# EAGLE design memory (EAGLE 7.1.0)
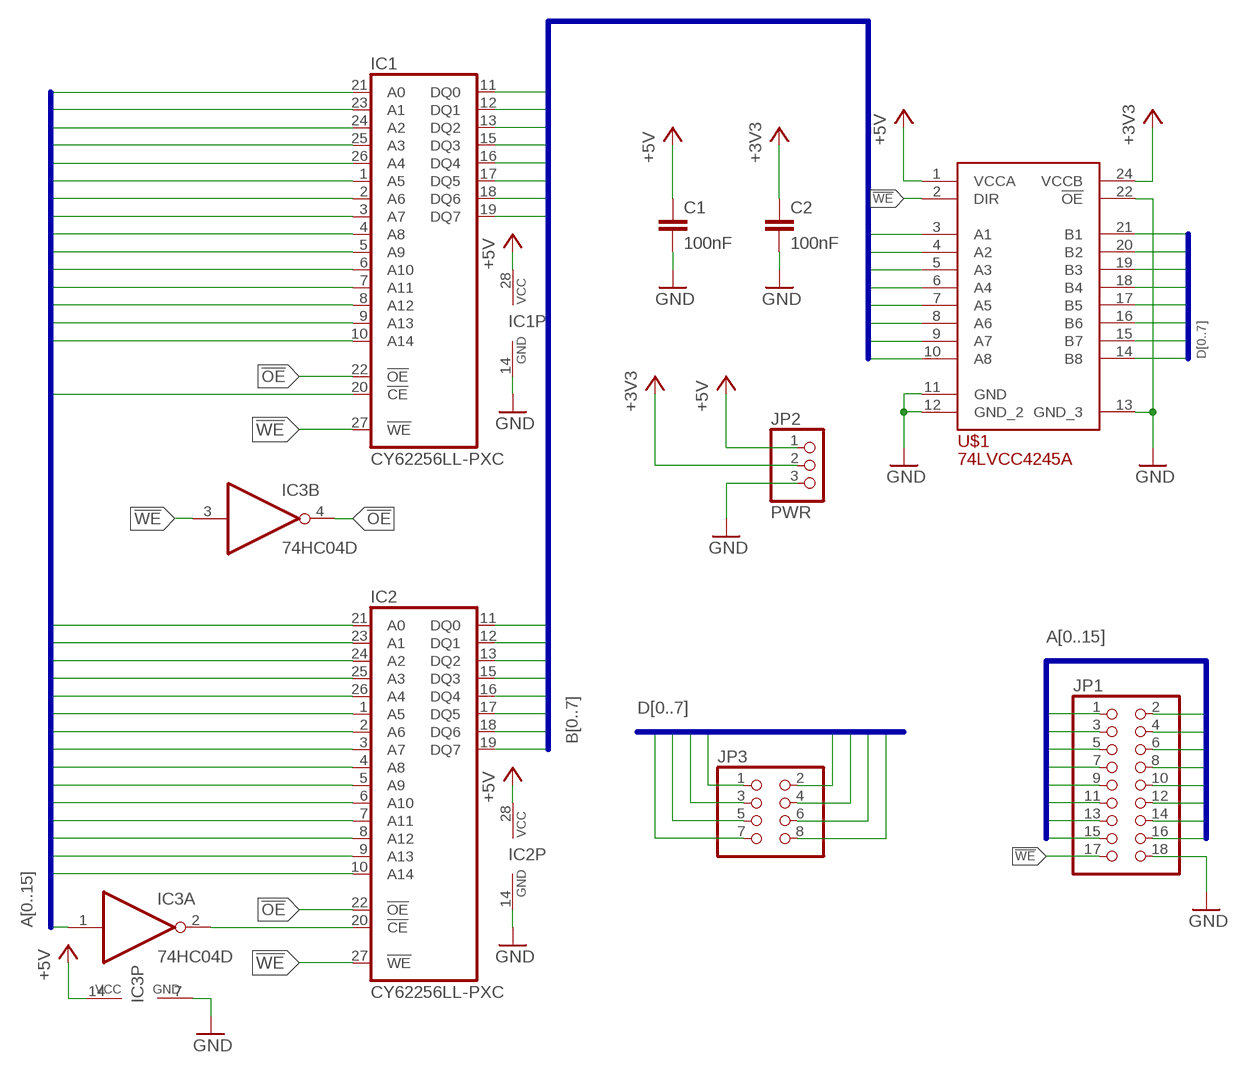
[diagram p0: schematic, sheet 1]

## Parts
C1  100nF  C-EUC0805  [C0805]
C2  100nF  C-EUC0805  [C0805]
IC1  CY62256LL-PXC  [DIL28-6]
IC2  CY62256LL-PXC  [DIL28-6]
IC3  74HC04D  [SO14]
JP1  PINHD-2X9  [2X09]
JP2  PWR  PINHD-1X3  [1X03]
JP3  PINHD-2X4  [2X04]
U$1  74LCC4245A  [SO24W]

## Nets
!OE!: IC1.22(!OE) IC2.22(!OE) IC3.4(B:O)
!WE!: IC1.27(!WE) IC2.27(!WE) IC3.3(B:I) JP1.17 U$1.2(DIR)
+3V3: C2.1 JP2.2 U$1.24(VCCB)
+5V: C1.1 IC1.28(VCC) IC2.28(VCC) IC3.14(P:VCC) JP2.1 U$1.1(VCCA)
A0: IC1.21(A0) IC2.21(A0) JP1.1
A1: IC1.23(A1) IC2.23(A1) JP1.2
A2: IC1.24(A2) IC2.24(A2) JP1.3
A3: IC1.25(A3) IC2.25(A3) JP1.4
A4: IC1.26(A4) IC2.26(A4) JP1.5
A5: IC1.1(A5) IC2.1(A5) JP1.6
A6: IC1.2(A6) IC2.2(A6) JP1.7
A7: IC1.3(A7) IC2.3(A7) JP1.8
A8: IC1.4(A8) IC2.4(A8) JP1.9
A9: IC1.5(A9) IC2.5(A9) JP1.10
A10: IC1.6(A10) IC2.6(A10) JP1.11
A11: IC1.7(A11) IC2.7(A11) JP1.12
A12: IC1.8(A12) IC2.8(A12) JP1.13
A13: IC1.9(A13) IC2.9(A13) JP1.14
A14: IC1.10(A14) IC2.10(A14) JP1.15
A15: IC1.20(!CE) IC3.1(A:I) JP1.16
B0: IC1.11(DQ0) IC2.11(DQ0) U$1.3(A1)
B1: IC1.12(DQ1) IC2.12(DQ1) U$1.4(A2)
B2: IC1.13(DQ2) IC2.13(DQ2) U$1.5(A3)
B3: IC1.15(DQ3) IC2.15(DQ3) U$1.6(A4)
B4: IC1.16(DQ4) IC2.16(DQ4) U$1.7(A5)
B5: IC1.17(DQ5) IC2.17(DQ5) U$1.8(A6)
B6: IC1.18(DQ6) IC2.18(DQ6) U$1.9(A7)
B7: IC1.19(DQ7) IC2.19(DQ7) U$1.10(A8)
D0: JP3.1 U$1.21(B1)
D1: JP3.2 U$1.20(B2)
D2: JP3.3 U$1.19(B3)
D3: JP3.4 U$1.18(B4)
D4: JP3.5 U$1.17(B5)
D5: JP3.6 U$1.16(B6)
D6: JP3.7 U$1.15(B7)
D7: JP3.8 U$1.14(B8)
GND: C1.2 C2.2 IC1.14(GND) IC2.14(GND) IC3.7(P:GND) JP1.18 JP2.3 U$1.11(GND) U$1.12(GND_2) U$1.13(GND_3) U$1.22(!OE!)
N$1: IC2.20(!CE) IC3.2(A:O)
Unconnected: IC3.5(C:I) IC3.6(C:O) IC3.8(D:O) IC3.9(D:I) IC3.10(E:O) IC3.11(E:I) IC3.12(F:O) IC3.13(F:I)

## Buses
B[0..7]
A[0..15]
D[0..7]

## Library data of the parts
C1 C2 = rcl:C-EU: CAPACITOR, European symbol
IC1 IC2 = memory-sram:CY62256LL-?*: 256K (32K x 8) CMOS-Static RAM Source: http://download.cypress.com.edgesuite.net/design_resources/datasheets/contents/cy62256_8.pdf
IC3 = 74xx-eu:74*04: Hex INVERTER
JP1 = pinhead:PINHD-2X9: PIN HEADER
JP2 = pinhead:PINHD-1X3: PIN HEADER
JP3 = pinhead:PINHD-2X4: PIN HEADER
U$1 = depmod:74LCC4245A

## Board
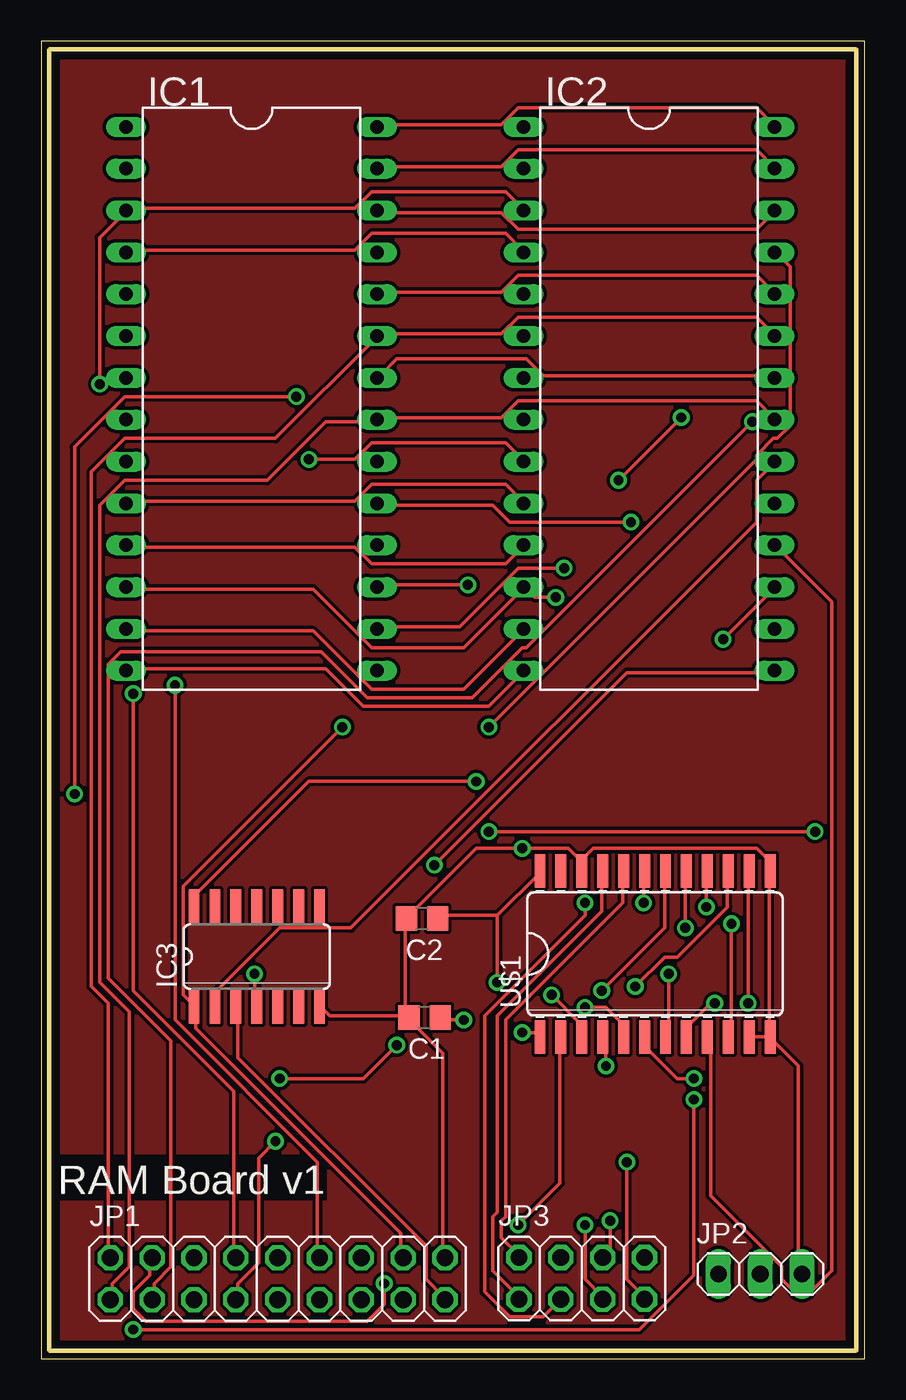
[diagram p1: board, top side]
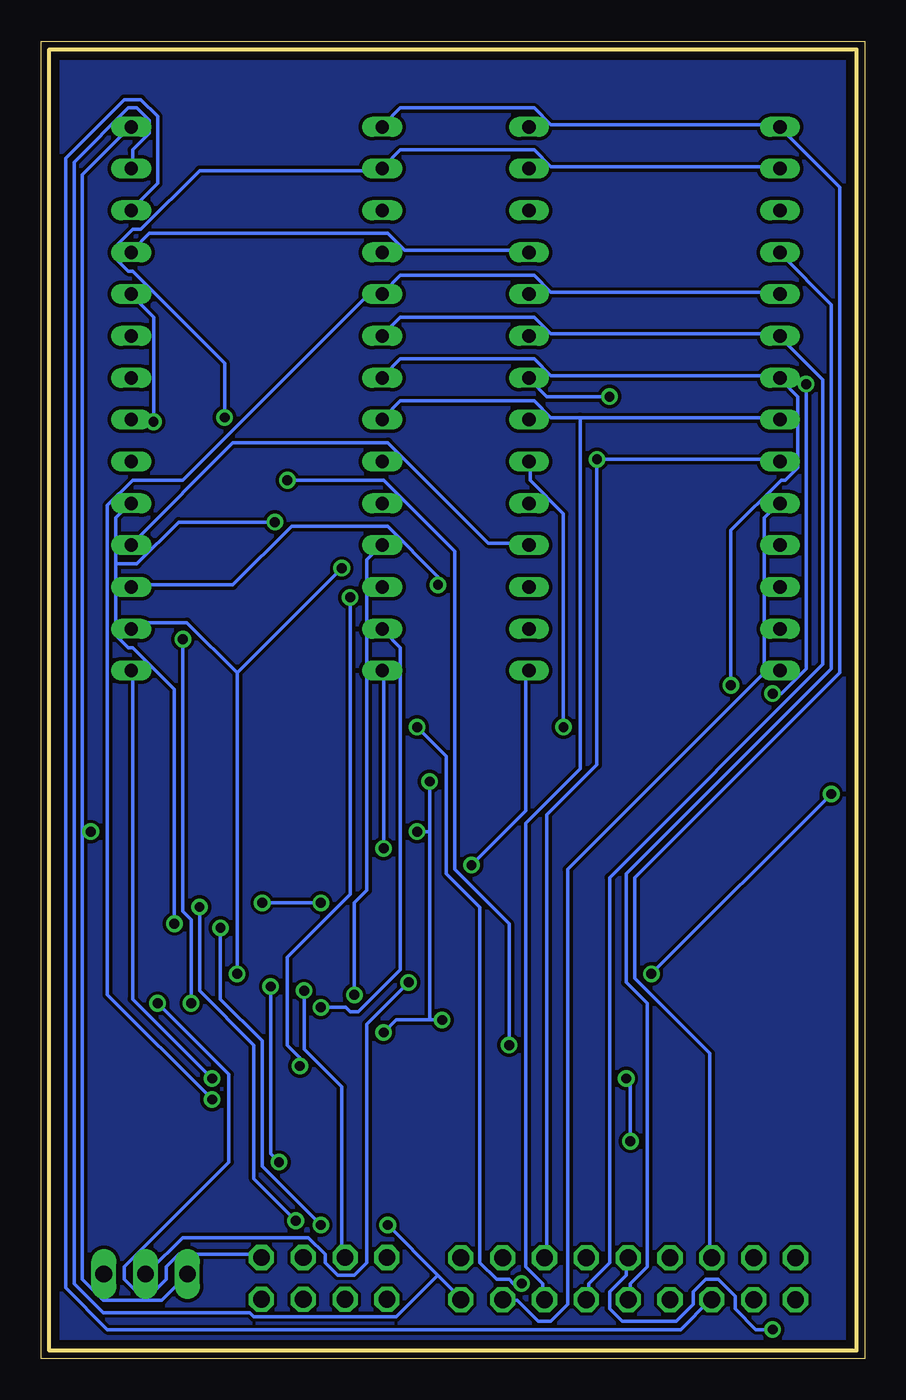
[diagram p2: board, bottom side, seen from below]

Size 50 x 80 mm. Coordinates in mm from the lower left corner, seen from the top.
Outline: 0,0 50,0 50,80 0,80 0,0
Outline: 0.5,0.5 49.5,0.5 49.5,79.5 0.5,79.5 0.5,0.5
Copper layers (1*16): Top 0.035mm / dielectric 1.5mm / Bottom 0.035mm
Design rules "8mils *": minimum track width 8mil, minimum drill 0.6mm, track to track 8mil, track to pad 8mil, pad to pad 8mil, via to via 8mil, smd to smd 0mil, copper to edge 20mil, drill to drill 10mil, minimum pad ring 8mil, minimum via ring 8mil, stop-mask expansion 0mil, vias tented up to drill 0mil, thermal gap 10mil

### Footprints (pad centres in the part's own frame; a part is rotated, then mirrored left to right if it is on the bottom)
C0805 = smd 1.3 x 1.5: 1 -0.95,0; 2 0.95,0
DIL28-6 = drill 0.813 long: 1 -16.51,-7.62; 2 -13.97,-7.62; 3 -11.43,-7.62; 4 -8.89,-7.62; 5 -6.35,-7.62; 6 -3.81,-7.62; 7 -1.27,-7.62; 8 1.27,-7.62; 9 3.81,-7.62; 10 6.35,-7.62; 11 8.89,-7.62; 12 11.43,-7.62; 13 13.97,-7.62; 14 16.51,-7.62; 15 16.51,7.62; 16 13.97,7.62; 17 11.43,7.62; 18 8.89,7.62; 19 6.35,7.62; 20 3.81,7.62; 21 1.27,7.62; 22 -1.27,7.62; 23 -3.81,7.62; 24 -6.35,7.62; 25 -8.89,7.62; 26 -11.43,7.62; 27 -13.97,7.62; 28 -16.51,7.62
SO14 = smd 0.66 x 2.032: 1 -3.81,-3.073; 2 -2.54,-3.073; 3 -1.27,-3.073; 4 0,-3.073; 5 1.27,-3.073; 6 2.54,-3.073; 7 3.81,-3.073; 8 3.81,3.073; 9 2.54,3.073; 10 1.27,3.073; 11 0,3.073; 12 -1.27,3.073; 13 -2.54,3.073; 14 -3.81,3.073
2X09 = drill 1.016 octagon: 1 -10.16,-1.27; 2 -10.16,1.27; 3 -7.62,-1.27; 4 -7.62,1.27; 5 -5.08,-1.27; 6 -5.08,1.27; 7 -2.54,-1.27; 8 -2.54,1.27; 9 0,-1.27; 10 0,1.27; 11 2.54,-1.27; 12 2.54,1.27; 13 5.08,-1.27; 14 5.08,1.27; 15 7.62,-1.27; 16 7.62,1.27; 17 10.16,-1.27; 18 10.16,1.27
1X03 = drill 1.016 long: 1 -2.54,0; 2 0,0; 3 2.54,0
2X04 = drill 1.016 octagon: 1 -3.81,-1.27; 2 -3.81,1.27; 3 -1.27,-1.27; 4 -1.27,1.27; 5 1.27,-1.27; 6 1.27,1.27; 7 3.81,-1.27; 8 3.81,1.27
SO24W = smd 0.66 x 2.032: 1 -6.985,-5.029; 2 -5.715,-5.029; 3 -4.445,-5.029; 4 -3.175,-5.029; 5 -1.905,-5.029; 6 -0.635,-5.029; 7 0.635,-5.029; 8 1.905,-5.029; 9 3.175,-5.029; 10 4.445,-5.029; 11 5.715,-5.029; 12 6.985,-5.029; 13 6.985,5.029; 14 5.715,5.029; 15 4.445,5.029; 16 3.175,5.029; 17 1.905,5.029; 18 0.635,5.029; 19 -0.635,5.029; 20 -1.905,5.029; 21 -3.175,5.029; 22 -4.445,5.029; 23 -5.715,5.029; 24 -6.985,5.029

### Placement (x,y rotation side)
C1  23.28,20.73 180 top
C2  23.13,26.73 180 top
IC1  12.77,58.29 270 top
IC2  36.91,58.29 270 top
IC3  13.09,24.42 0 top
JP1  14.36,4.86 0 top
JP2  43.66,5.15 0 top
JP3  32.82,4.88 0 top
U$1  37.27,24.58 0 top

### Tracks (layer width: path | path; a pad name or v marks a point on that pad's centre or on a via)
!OE!  (via drill 0.6)
  Top 0.203: v12.95,23.37 12.95,21.59 IC3.4 | v2.03,34.29 2.03,55.37 5.08,58.42 v15.49,58.42 | IC2.22 44.45,59.69 30.48,59.69 29.46,60.71 21.59,60.71 20.57,59.69 IC1.22
  Bottom 0.203: v2.03,34.29 v12.95,23.37 | v15.49,58.42 19.3,58.42 20.32,59.44 IC1.22
!WE!  (via drill 0.6)
  Top 0.203: IC1.27 20.57,72.39 27.94,72.39 28.96,73.41 43.43,73.41 44.45,72.39 IC2.27 | IC3.3 11.94,21.34 11.94,18.29 23.37,6.86 23.37,4.83 24.38,3.81 JP1.17 | v28.96,8.13 31.5,10.67 31.5,19.3 U$1.2
  Bottom 0.203: 25.91,5.08 24.64,3.81 JP1.17 | 25.91,5.08 v28.96,8.13 | 25.91,5.08 28.45,2.54 37.08,2.54 37.34,2.79 46.23,2.79 48.01,4.57 48.01,72.64 44.7,75.95 44.2,75.95 43.43,75.18 43.43,74.42 44.45,73.41 44.45,72.39 IC2.27
+3V3  (via drill 0.6)
  Top 0.203: 27.69,26.92 24.13,26.92 C2.1 | 27.69,26.92 30.23,29.46 U$1.24 | 27.69,26.92 v27.69,22.86
  Bottom 0.203: v27.69,22.86 30.23,20.32 30.23,5.84 30.99,5.08 32,5.08 32.77,5.84 32.77,6.35 33.78,7.37 41.4,7.37 43.43,5.33 JP2.2
+5V  (via drill 0.6)
  Top 0.203: v25.65,20.57 24.38,20.57 C1.1 | v29.21,19.81 29.97,19.81 30.23,19.56 U$1.1 | v26.42,35.05 16.26,35.05 9.4,28.19 9.4,27.69 IC3.14 | IC1.28 20.57,74.93 27.94,74.93 28.96,75.95 43.43,75.95 44.45,74.93 IC2.28 | v46.99,32 v27.18,32
  Bottom 0.203: 26.42,20.57 28.45,20.57 v29.21,19.81 | 26.42,20.57 v25.65,20.57 | 26.42,20.57 26.42,32 | 26.42,32 v26.42,35.05 | 47.5,32 47.5,71.88 44.7,74.68 IC2.28 | 47.5,32 47.5,4.83 46.23,3.56 42.67,3.56 41.15,5.08 JP2.1 | v27.18,32 26.42,32 | 47.5,32 v46.99,32
A0
  Top 0.203: IC2.21 44.45,57.15 43.43,58.17 28.96,58.17 27.94,57.15 20.57,57.15 IC1.21 20.32,56.9 17.27,56.9 13.72,53.34 5.08,53.34 3.56,51.82 3.56,22.86 5.33,21.08 5.33,5.59 4.32,4.57 4.32,3.81 JP1.1
A1
  Top 0.203: IC2.23 44.45,62.23 43.43,63.25 28.96,63.25 27.94,62.23 20.57,62.23 IC1.23 20.32,61.98 14.22,55.88 5.08,55.88 3.05,53.85 3.05,22.61 4.06,21.59 4.06,6.35 JP1.2
A2  (via drill 0.6)
  Top 0.203: IC1.24 20.57,64.77 27.94,64.77 28.96,65.79 43.43,65.79 44.45,64.77 IC2.24 | v43.18,56.9 29.46,43.18 29.21,43.18 26.16,40.13 19.81,40.13 17.02,42.93 4.83,42.93 4.06,42.16 4.06,23.11 7.87,19.3 7.87,5.59 6.86,4.57 6.86,3.81 JP1.3
  Bottom 0.203: v43.18,56.9 43.18,63.25 44.45,64.52 IC2.24
A3  (via drill 0.6)
  Top 0.203: v20.83,4.57 20.83,3.3 19.81,2.29 6.35,2.29 5.59,3.05 5.59,4.06 6.6,5.08 6.6,6.1 JP1.4 | v27.18,38.35 43.43,54.61 43.43,54.86 44.45,55.88 44.7,55.88 45.47,56.64 45.47,66.29 44.7,67.06 IC2.25
  Bottom 0.203: IC1.25 20.57,67.31 27.94,67.31 28.96,68.33 43.43,68.33 44.45,67.31 IC2.25 | v20.83,4.57 21.34,4.57 21.59,4.83 22.35,4.83 23.37,5.84 23.37,27.43 25.4,29.46 25.4,36.58 v27.18,38.35
A4
  Top 0.203: IC1.26 20.57,69.6 27.94,69.6 28.96,68.58 43.43,68.58 44.45,69.6 IC2.26
  Bottom 0.203: JP1.5 9.4,3.56 11.18,1.78 45.97,1.78 48.51,4.32 48.51,72.9 44.96,76.45 43.94,76.45 42.93,75.44 42.93,71.37 44.45,69.85 IC2.26
A5
  Bottom 0.203: IC2.1 29.21,74.93 28.19,75.95 20.07,75.95 19.05,74.93 5.33,74.93 IC1.1 5.08,74.68 1.52,71.12 1.52,41.66 13.97,29.21 13.97,23.11 9.4,18.54 9.4,6.35 JP1.6
A6  (via drill 0.6)
  Top 0.203: v14.22,13.21 13.21,12.19 13.21,5.84 11.94,4.57 11.94,3.81 JP1.7 | v14.48,17.02 19.56,17.02 v21.59,19.05 | v38.86,57.15 v35.05,53.34
  Bottom 0.203: IC1.2 5.33,72.39 19.05,72.39 20.07,73.41 28.19,73.41 29.21,72.39 IC2.2 29.46,72.14 40.39,72.14 43.94,68.58 44.45,68.58 45.47,67.56 45.47,66.8 44.7,66.04 44.45,66.04 38.86,60.45 v38.86,57.15 | v14.22,13.21 14.22,16.76 v14.48,17.02 | v21.59,19.05 21.59,26.42 24.89,29.72 24.89,49.02 29.21,53.34 v35.05,53.34
A7  (via drill 0.6)
  Top 0.203: IC2.3 29.21,69.85 28.19,70.87 20.07,70.87 19.05,69.85 5.33,69.85 IC1.3 5.08,69.6 3.56,68.07 v3.56,59.18 | v5.59,40.39 5.59,22.35 11.68,16.26 11.68,6.35 JP1.8
  Bottom 0.203: v5.59,40.39 5.08,40.39 3.56,41.91 v3.56,59.18
A8
  Top 0.203: IC1.4 5.33,67.31 19.05,67.31 20.07,68.33 28.19,68.33 29.21,67.31 IC2.4
  Bottom 0.203: JP1.9 14.22,3.81 14.22,4.57 13.21,5.59 13.21,21.59 14.48,22.86 14.48,29.46 2.03,41.91 2.03,64.01 5.08,67.06 IC1.4
A9  (via drill 0.6)
  Top 0.203: v5.59,1.78 36.32,1.78 39.62,5.08 v39.62,15.75
  Bottom 0.203: IC1.5 5.33,64.77 19.05,64.77 20.07,65.79 28.19,65.79 29.21,64.77 IC2.5 29.46,64.52 30.23,64.52 41.4,53.34 44.45,53.34 45.97,51.82 45.97,22.1 v39.62,15.75 | v5.59,1.78 6.6,1.78 7.87,3.05 7.87,3.81 8.89,4.83 9.65,4.83 10.41,4.06 10.41,3.3 11.43,2.29 14.73,2.29 15.49,3.05 15.49,4.06 14.48,5.08 14.48,6.1 JP1.10
A10
  Bottom 0.203: IC2.6 29.21,62.23 28.19,63.25 20.07,63.25 19.05,62.23 5.33,62.23 IC1.6 5.08,61.98 2.54,59.44 2.54,42.16 15.49,29.21 15.49,5.84 16.76,4.57 16.76,3.81 JP1.11
A11  (via drill 0.6)
  Top 0.203: v8.13,40.89 8.13,20.57 16.76,11.94 16.76,6.35 JP1.12
  Bottom 0.203: IC2.7 29.21,59.69 28.19,60.71 20.07,60.71 19.05,59.69 5.33,59.69 IC1.7 5.08,59.44 4.06,58.42 4.06,54.1 4.83,53.34 5.08,53.34 8.13,50.29 v8.13,40.89
A12
  Bottom 0.203: 17.27,57.15 19.05,57.15 20.07,58.17 28.19,58.17 29.21,57.15 IC2.8 | 17.27,57.15 5.33,57.15 IC1.8 | 17.27,57.15 17.27,35.81 20.57,32.51 20.57,5.59 19.56,4.57 19.56,3.81 JP1.13
A13  (via drill 0.6)
  Top 0.203: v16.26,54.61 19.05,54.61 20.07,55.63 28.19,55.63 29.21,54.61 IC2.9
  Bottom 0.203: IC1.9 5.33,54.61 v16.26,54.61 16.26,36.07 19.3,33.02 19.3,6.35 JP1.14
A14
  Top 0.203: IC1.10 5.33,52.07 19.05,52.07 20.07,53.09 28.19,53.09 29.21,52.07 IC2.10
  Bottom 0.203: JP1.15 21.84,3.56 21.08,3.56 19.81,2.29 19.05,2.29 18.03,3.3 18.03,29.72 6.1,41.66 6.1,51.05 5.33,51.82 IC1.10
A15  (via drill 0.6)
  Top 0.203: JP1.16 21.84,6.35 21.84,7.62 9.4,20.07 9.4,21.34 IC3.1 9.14,21.59 8.64,22.1 8.64,28.7 v18.29,38.35
  Bottom 0.203: v18.29,38.35 18.29,51.31 20.32,53.34 20.32,54.36 IC1.20
B0  (via drill 0.6)
  Top 0.203: v30.99,22.1 32.77,20.32 32.77,19.56 U$1.3 | IC1.11 5.33,49.28 19.05,49.28 20.07,48.26 28.19,48.26 29.21,49.28 IC2.11
  Bottom 0.203: v30.99,22.1 30.99,27.69 30.23,28.45 30.23,48.51 29.46,49.28 IC2.11
B1  (via drill 0.6)
  Top 0.203: v34.29,17.78 34.29,19.3 U$1.4 | v31.24,46.23 29.97,46.23 29.46,46.74 IC2.12 29.21,46.74 25.65,43.18 20.07,43.18 16.51,46.74 5.33,46.74 IC1.12
  Bottom 0.203: v34.29,17.78 34.29,18.29 35.05,19.05 35.05,24.38 31.24,28.19 v31.24,46.23
B2  (via drill 0.6)
  Top 0.203: v33.02,21.34 34.29,21.34 35.31,20.32 35.31,19.56 U$1.5 | IC1.13 5.33,44.2 16.51,44.2 20.07,40.64 25.65,40.64 29.21,44.2 IC2.13
  Bottom 0.203: v33.02,21.34 31.5,21.34 31.24,21.08 30.73,21.08 28.19,23.62 28.19,43.18 29.21,44.2 IC2.13
B3  (via drill 0.6)
  Top 0.203: v39.62,17.02 38.61,17.02 36.83,18.8 36.83,19.3 U$1.6 | v23.88,29.97 35.56,41.66 44.45,41.66 IC2.15
  Bottom 0.203: v39.62,17.02 44.45,21.84 44.45,41.66 IC2.15 | v23.88,29.97 20.57,33.27 20.57,41.66 IC1.15
B4  (via drill 0.6)
  Top 0.203: v38.1,23.37 38.1,19.56 U$1.7 | v31.75,48.01 28.96,48.01 25.4,44.45 20.57,44.45 IC1.16
  Bottom 0.203: 38.1,41.66 v38.1,23.37 | 38.1,41.66 41.15,44.7 44.2,44.7 44.45,44.45 IC2.16 | 38.1,41.66 v31.75,48.01
B5  (via drill 0.6)
  Top 0.203: v40.89,21.59 40.64,21.59 39.37,20.32 39.37,19.56 U$1.8 | v41.4,43.69 44.45,46.74 IC2.17 | v25.91,46.99 20.57,46.99 IC1.17
  Bottom 0.203: v40.89,21.59 40.89,26.67 41.4,27.18 v41.4,43.69 | v25.91,46.99 25.91,47.5 28.96,50.55 34.8,50.55 38.35,46.99 44.45,46.99 IC2.17
B6
  Top 0.203: U$1.9 40.64,19.3 40.64,9.91 44.96,5.59 44.96,4.83 45.72,4.06 46.74,4.06 48.01,5.33 48.01,45.97 44.7,49.28 IC2.18
  Bottom 0.203: IC1.18 20.57,49.53 22.86,49.53 28.96,55.63 38.35,55.63 44.45,49.53 IC2.18
B7  (via drill 0.6)
  Top 0.203: v41.91,26.42 41.91,19.56 U$1.10 | v35.81,50.8 28.45,50.8 27.43,51.82 20.57,51.82 IC1.19
  Bottom 0.203: v41.91,26.42 41.91,40.64 44.45,43.18 44.7,43.18 45.47,43.94 45.47,48.26 | 45.47,48.26 45.47,51.05 44.7,51.82 IC2.19 | v35.81,50.8 41.66,50.8 44.2,48.26 45.47,48.26
D0
  Top 0.203: U$1.21 34.04,29.46 34.04,27.18 27.69,20.83 27.69,8.89 27.43,8.64 27.43,5.33 28.96,3.81 JP3.1
D1
  Top 0.203: U$1.20 35.31,29.46 35.31,27.69 28.19,20.57 28.19,8.64 27.94,8.38 27.94,7.37 28.96,6.35 JP3.2
D2  (via drill 0.6)
  Top 0.203: v36.58,27.69 36.58,29.46 U$1.19 | v33.02,27.69 33.02,26.92 26.92,20.83 26.92,4.06 28.45,2.54 30.48,2.54 JP3.3
  Bottom 0.203: v33.02,27.69 v36.58,27.69
D3  (via drill 0.6)
  Top 0.203: v34.04,22.35 37.85,26.16 37.85,29.46 U$1.18
  Bottom 0.203: v34.04,22.35 34.04,18.8 31.75,16.51 31.75,6.35 JP3.4
D4  (via drill 0.6)
  Top 0.203: v39.12,26.16 39.12,29.46 U$1.17 | v33.02,8.13 33.02,4.83 34.04,3.81 JP3.5
  Bottom 0.203: v39.12,26.16 39.12,21.84 36.58,19.3 36.58,11.68 v33.02,8.13
D5  (via drill 0.6)
  Top 0.203: v40.39,27.43 40.39,29.46 U$1.16 | v34.54,8.38 34.54,6.6 JP3.6
  Bottom 0.203: v40.39,27.43 40.39,22.35 37.08,19.05 37.08,10.92 v34.54,8.38
D6  (via drill 0.6)
  Top 0.203: v36.07,22.61 37.85,24.38 38.61,24.38 41.66,27.43 41.66,29.46 U$1.15 | v35.56,11.94 35.56,4.83 36.58,3.81 JP3.7
  Bottom 0.203: v36.07,22.61 36.07,12.45 v35.56,11.94
D7  (via drill 0.6)
  Top 0.203: v42.93,21.59 42.93,29.46 U$1.14
  Bottom 0.203: v42.93,21.59 38.61,17.27 38.61,11.94 44.96,5.59 44.96,4.83 44.2,4.06 43.18,4.06 42.42,4.83 42.42,5.59 41.66,6.35 36.83,6.35 JP3.8
GND  (via drill 0.6)
  Top 0.203: 44.2,19.56 43.18,19.56 U$1.11 | 44.2,19.56 44.2,29.46 U$1.13 44.2,29.72 44.2,30.23 43.43,30.99 33.53,30.99 32.77,30.23 | 44.2,19.56 U$1.12 44.45,19.3 45.97,17.78 45.97,5.33 JP2.3 | IC1.14 5.33,41.91 17.27,41.91 19.56,39.62 27.18,39.62 29.21,41.66 IC2.14 | 22.1,20.83 17.53,20.83 17.02,21.34 IC3.7 | 22.1,20.83 22.1,26.67 C2.2 22.35,26.92 26.42,30.99 v29.21,30.99 32,30.99 32.77,30.23 | 22.1,20.83 C1.2 22.35,20.57 24.38,18.54 24.38,6.35 JP1.18 | 32.77,30.23 32.77,29.72 U$1.22 32.77,30.23
  Bottom 0.203: v29.21,30.99 29.21,41.66 IC2.14
N$1
  Top 0.203: IC3.2 10.67,21.59 10.67,22.35 14.48,26.16 18.8,26.16 43.43,50.8 43.43,53.34 44.45,54.36 IC2.20
N$2
  pour Bottom: 0.5,79.5 49.5,79.5 49.5,0.5 0.5,0.5
N$3
  pour Top: 0.5,9.5 17.5,9.5 17.5,12.5 0.5,12.5 0.5,79.5 49.5,79.5 49.5,0.5 0.5,0.5

### Text on the board
tNames: RAM Board v1